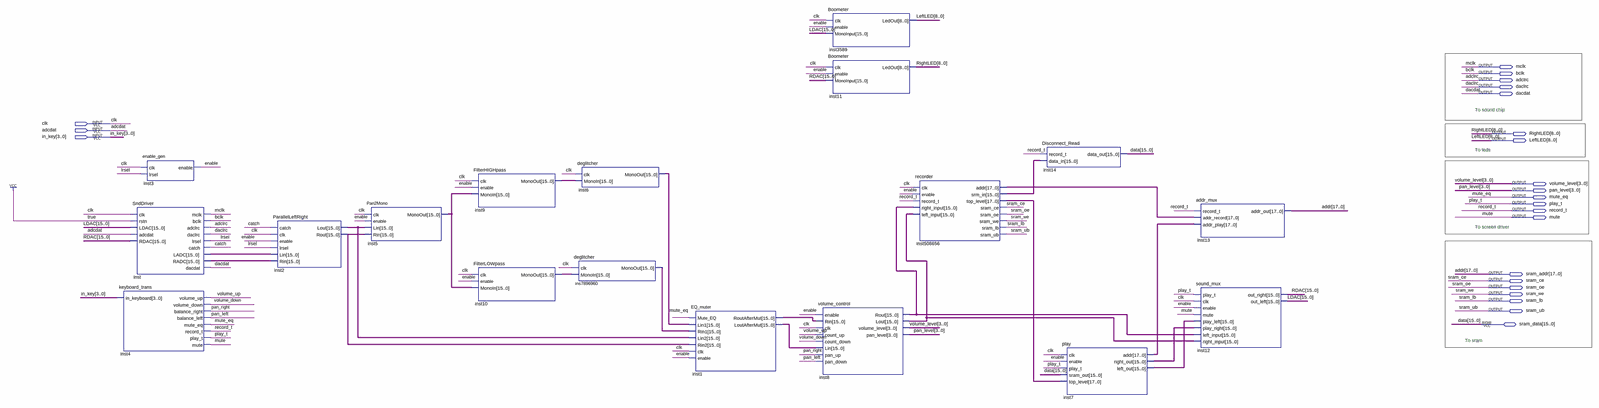
[diagram p0: schematic sheet, whole]
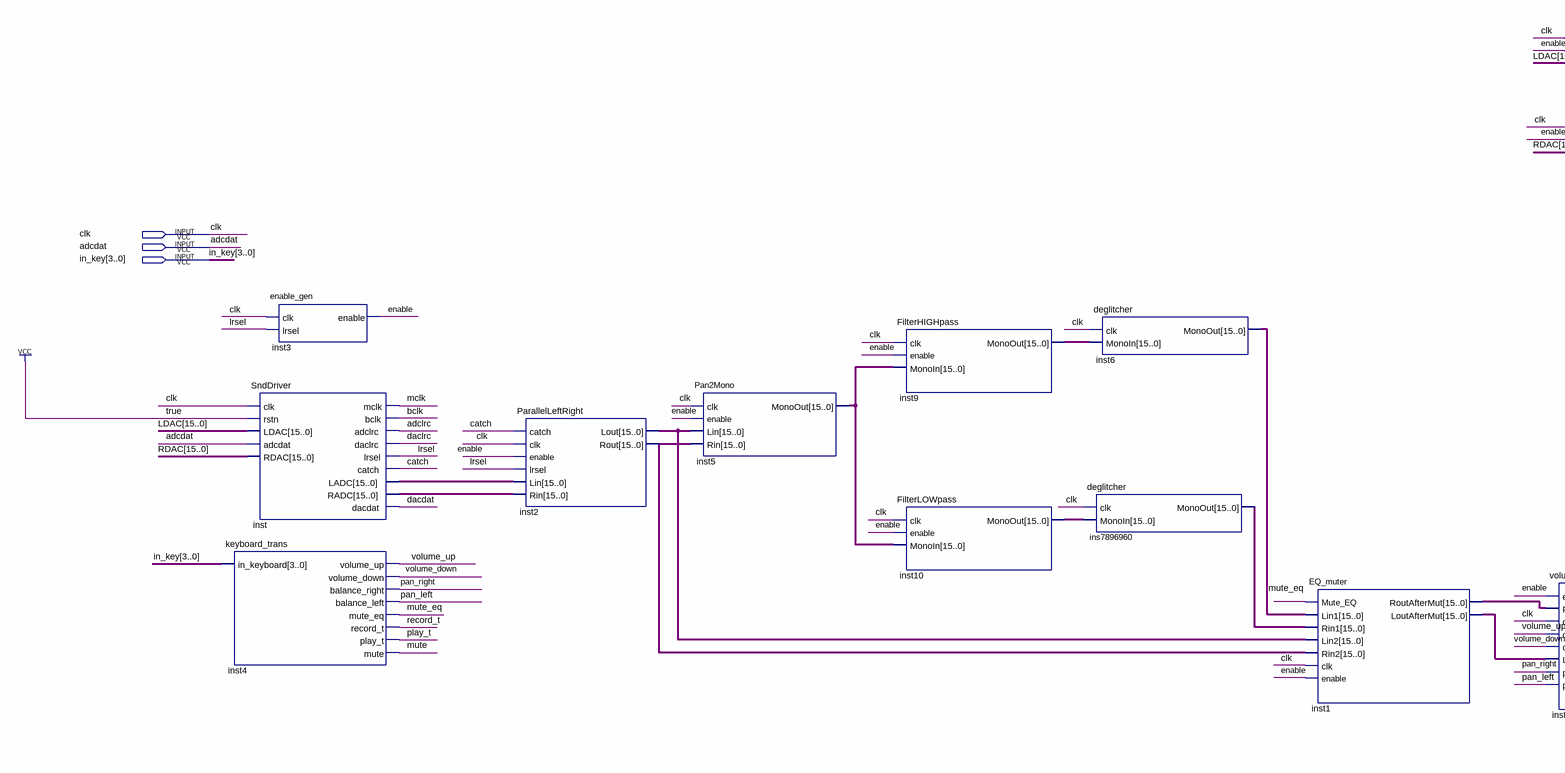
[diagram p1: schematic sheet, left part]
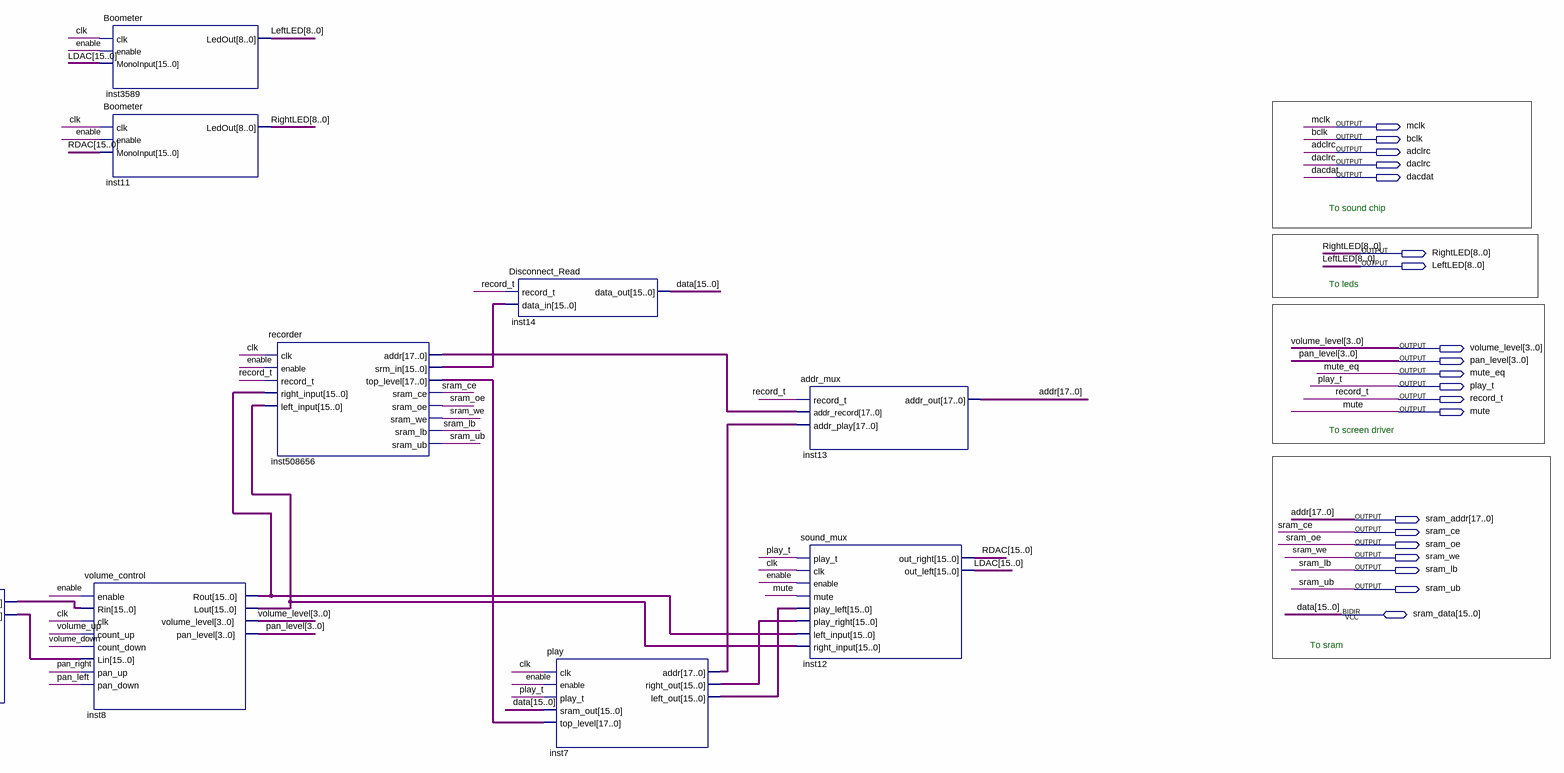
[diagram p2: schematic sheet, right part]
// Quartus schematic SoundControl.bdf as structural Verilog: 18 symbols, 23 pins
module SoundControl (
  input  clk,
  input  adcdat,
  input  [3:0] in_key,
  inout  [15:0] sram_data,
  output mclk,
  output bclk,
  output adclrc,
  output daclrc,
  output dacdat,
  output [8:0] RightLED,
  output [8:0] LeftLED,
  output [3:0] volume_level,
  output [3:0] pan_level,
  output mute_eq,
  output play_t,
  output record_t,
  output mute,
  output [17:0] sram_addr,
  output sram_ce,
  output sram_oe,
  output sram_we,
  output sram_lb,
  output sram_ub
);

  wire catch, enable, lrsel, pan_left, pan_right, volume_down, volume_up;
  wire [15:0] ins7896960_monoout, inst1_loutaftermut, inst1_routaftermut, inst2_lout, inst2_rout,
       inst5_monoout, inst6_monoout, inst7_left_out, inst7_right_out, inst8_lout, inst8_rout, inst9_monoout,
       inst10_monoout, inst508656_srm_in, inst_ladc, inst_radc, LDAC, RDAC;
  wire [17:0] inst7_addr, inst508656_addr, inst508656_top_level;

  enable_gen inst3 (.clk(clk), .lrsel(lrsel), .enable(enable));
  SndDriver inst (
    .clk(clk), .rstn(1'b1), .LDAC(LDAC), .adcdat(adcdat), .RDAC(RDAC), .mclk(mclk), .bclk(bclk),
    .adclrc(adclrc), .daclrc(daclrc), .lrsel(lrsel), .catch(catch), .LADC(inst_ladc), .RADC(inst_radc),
    .dacdat(dacdat));
  keyboard_trans inst4 (
    .in_keyboard(in_key), .volume_up(volume_up), .volume_down(volume_down), .balance_right(pan_right),
    .balance_left(pan_left), .mute_eq(mute_eq), .record_t(record_t), .play_t(play_t), .mute(mute));
  ParallelLeftRight inst2 (
    .catch(catch), .clk(clk), .enable(enable), .lrsel(lrsel), .Lin(inst_ladc), .Rin(inst_radc),
    .Lout(inst2_lout), .Rout(inst2_rout));
  Pan2Mono inst5 (.clk(clk), .enable(enable), .Lin(inst2_lout), .Rin(inst2_rout), .MonoOut(inst5_monoout));
  FilterHIGHpass inst9 (.clk(clk), .enable(enable), .MonoIn(inst5_monoout), .MonoOut(inst9_monoout));
  FilterLOWpass inst10 (.clk(clk), .enable(enable), .MonoIn(inst5_monoout), .MonoOut(inst10_monoout));
  deglitcher inst6 (.clk(clk), .MonoIn(inst9_monoout), .MonoOut(inst6_monoout));
  deglitcher ins7896960 (.clk(clk), .MonoIn(inst10_monoout), .MonoOut(ins7896960_monoout));
  EQ_muter inst1 (
    .Mute_EQ(mute_eq), .Lin1(inst6_monoout), .Rin1(ins7896960_monoout), .Lin2(inst2_lout), .Rin2(inst2_rout),
    .clk(clk), .enable(enable), .RoutAfterMut(inst1_routaftermut), .LoutAfterMut(inst1_loutaftermut));
  Boometer inst3589 (.clk(clk), .enable(enable), .MonoInput(LDAC), .LedOut(LeftLED));
  Boometer inst11 (.clk(clk), .enable(enable), .MonoInput(RDAC), .LedOut(RightLED));
  volume_control inst8 (
    .enable(enable), .Rin(inst1_routaftermut), .clk(clk), .count_up(volume_up), .count_down(volume_down),
    .Lin(inst1_loutaftermut), .pan_up(pan_right), .pan_down(pan_left), .Rout(inst8_rout), .Lout(inst8_lout),
    .volume_level(volume_level), .pan_level(pan_level));
  recorder inst508656 (
    .clk(clk), .enable(enable), .record_t(record_t), .right_input(inst8_rout), .left_input(inst8_lout),
    .addr(inst508656_addr), .srm_in(inst508656_srm_in), .top_level(inst508656_top_level), .sram_ce(sram_ce),
    .sram_oe(sram_oe), .sram_we(sram_we), .sram_lb(sram_lb), .sram_ub(sram_ub));
  Disconnect_Read inst14 (.record_t(record_t), .data_in(inst508656_srm_in), .data_out(sram_data));
  play inst7 (
    .clk(clk), .enable(enable), .play_t(play_t), .sram_out(sram_data), .top_level(inst508656_top_level),
    .addr(inst7_addr), .right_out(inst7_right_out), .left_out(inst7_left_out));
  addr_mux inst13 (.record_t(record_t), .addr_record(inst508656_addr), .addr_play(inst7_addr), .addr_out(sram_addr));
  sound_mux inst12 (
    .play_t(play_t), .clk(clk), .enable(enable), .mute(mute), .play_left(inst7_left_out),
    .play_right(inst7_right_out), .left_input(inst8_rout), .right_input(inst8_lout), .out_right(RDAC),
    .out_left(LDAC));

  // Other names for the same wires on the sheet: addr[17:0] = sram_addr; data[15:0] = sram_data

  // Notes on the sheet:
  //   To sound chip
  //   To leds
  //   To screen driver
  //   To sram
endmodule
